# EAGLE schematic NSE2022_BATTERY_ver0 (EAGLE 9.6.0)
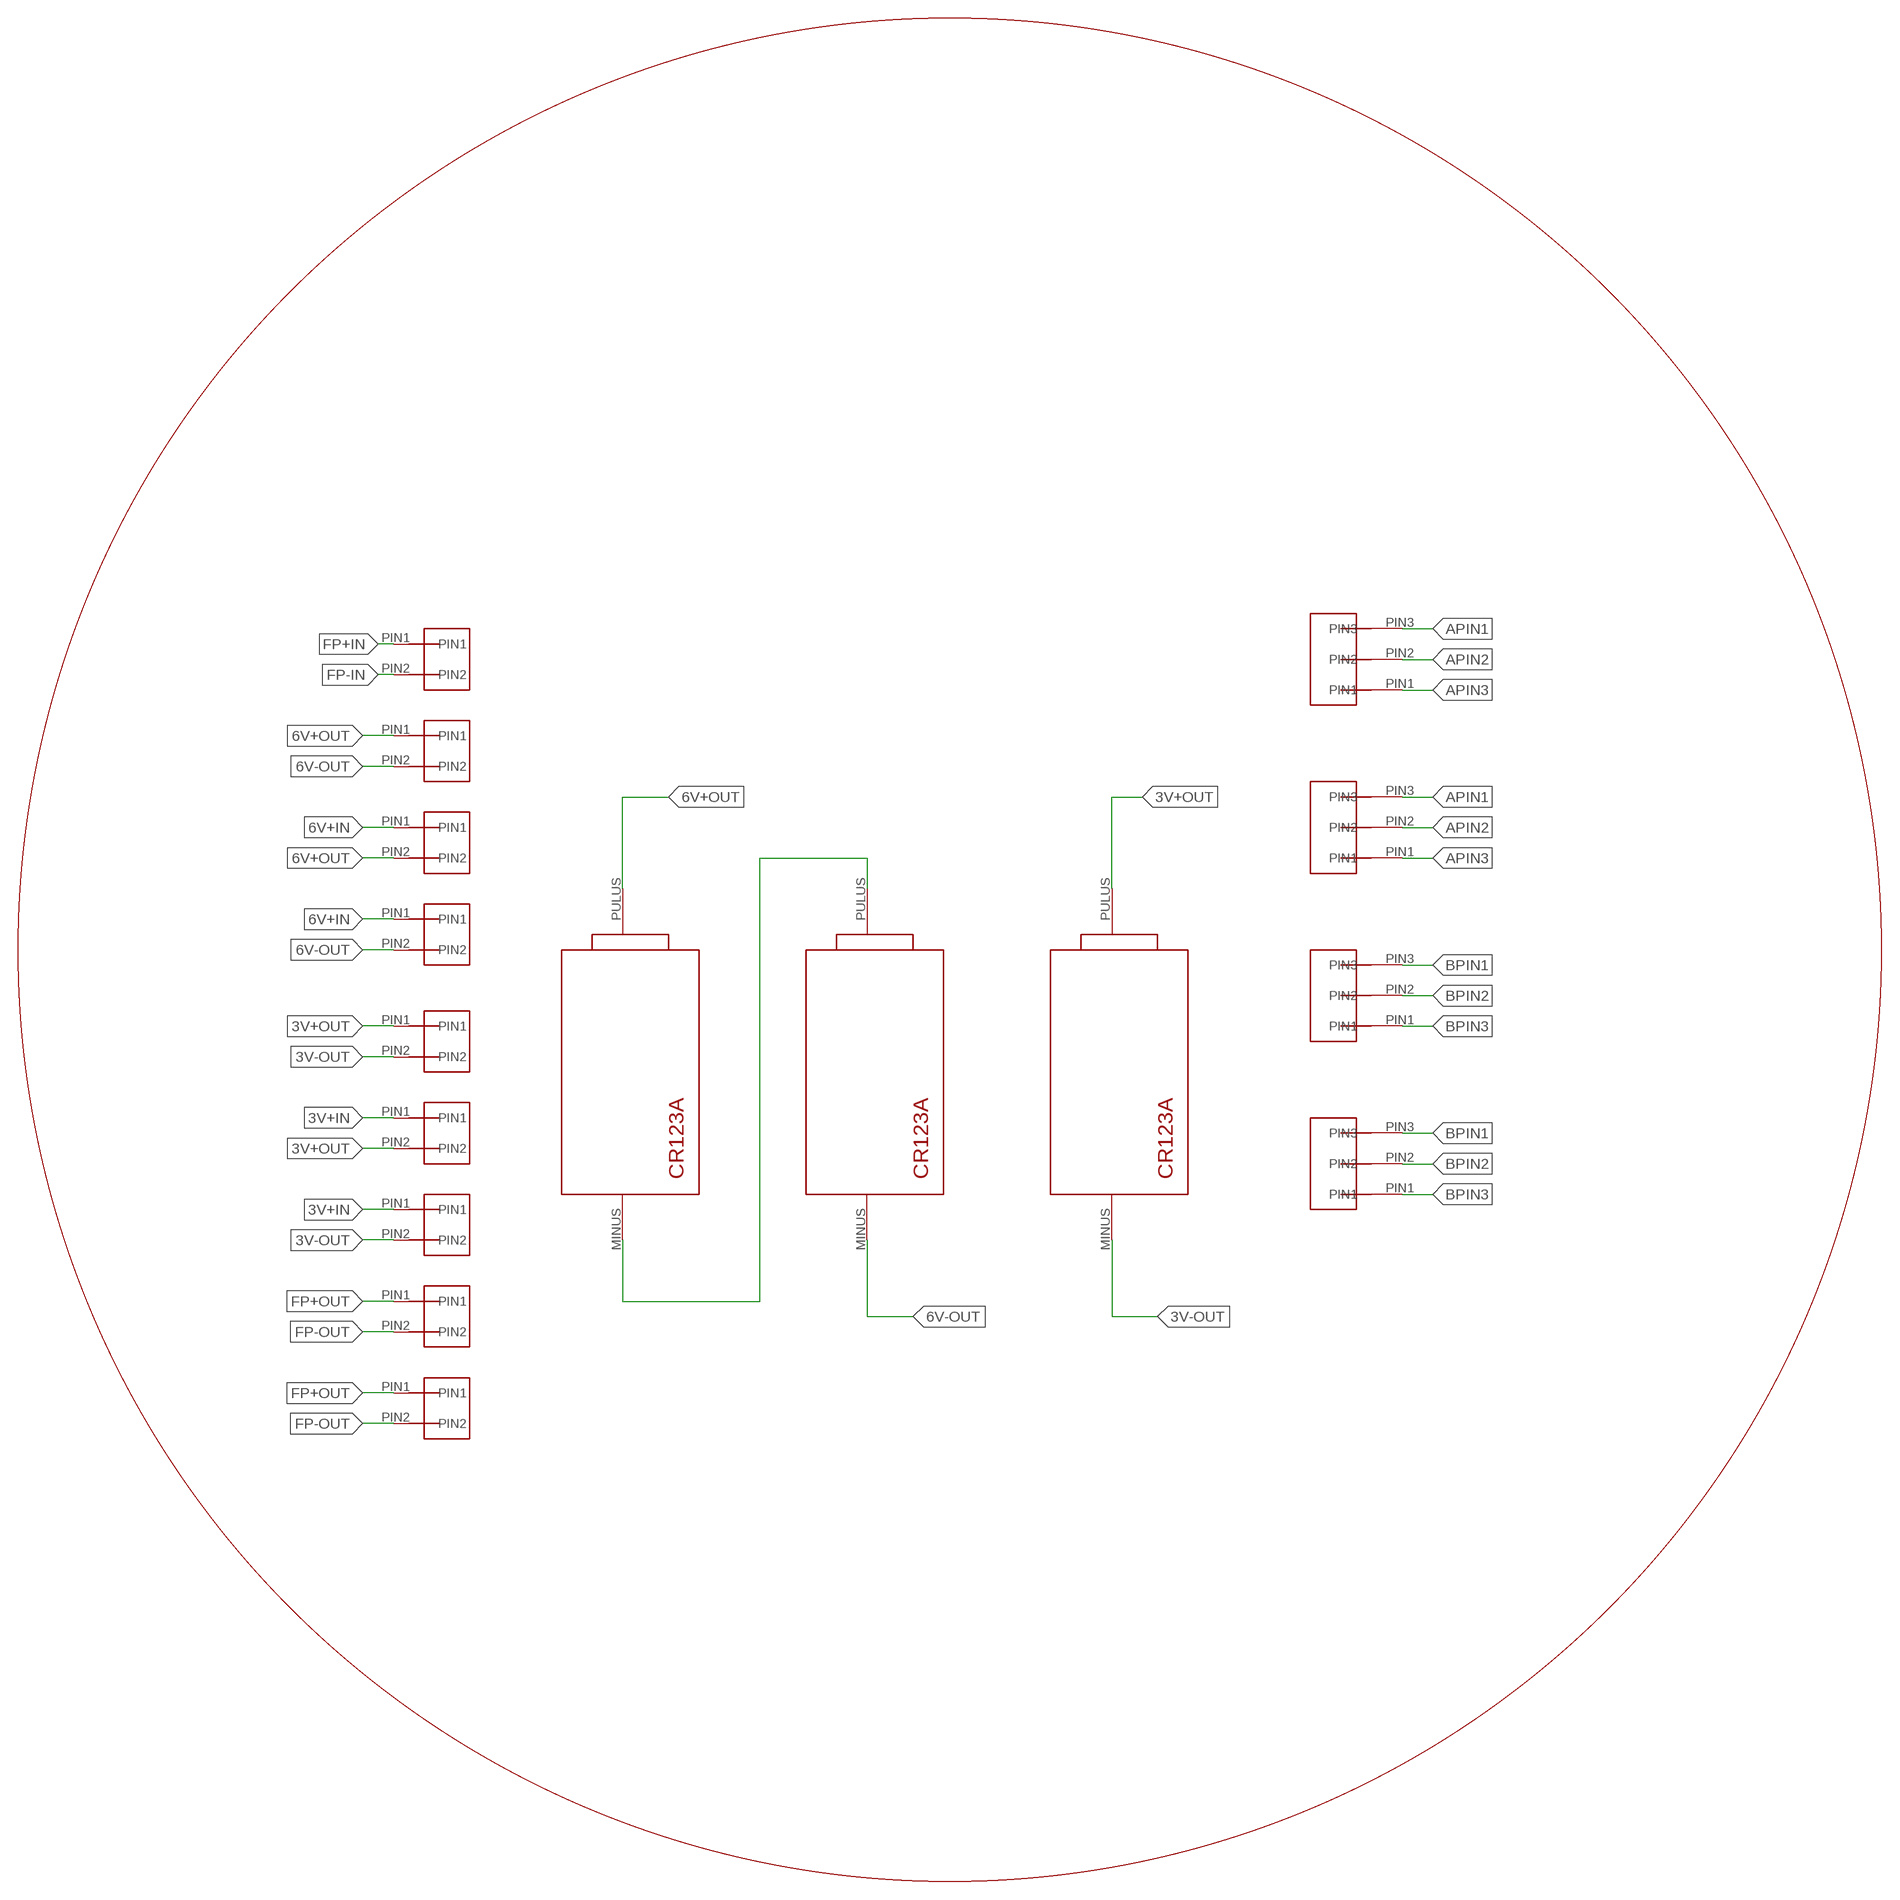
[diagram p0: schematic, sheet 1]

## Parts
U$25  CR123A  [CR123A]
U$34  CR123A  [CR123A]
U$38  CR123A  [CR123A]
U$41  2PIN  [2PIN]
U$45  2PIN  [2PIN]
U$56  2PIN  [2PIN]
U$57  2PIN  [2PIN]
U$58  2PIN  [2PIN]
U$59  3PIN  [3PIN]
U$60  3PIN  [3PIN]
U$61  3PIN  [3PIN]
U$62  3PIN  [3PIN]
U$65  2PIN  [2PIN]
U$66  2PIN  [2PIN]
U$67  2PIN  [2PIN]
U$68  2PIN  [2PIN]

## Nets
3V+IN: U$56.PIN1 U$65.PIN1
3V+OUT: U$38.PULUS(PULAS) U$45.PIN1 U$56.PIN2
3V-OUT: U$38.MINUS U$45.PIN2 U$65.PIN2
6V+IN: U$67.PIN1 U$68.PIN1
6V+OUT: U$25.PULUS(PULAS) U$41.PIN1 U$67.PIN2
6V-OUT: U$34.MINUS U$41.PIN2 U$68.PIN2
APIN1: U$59.PIN3 U$60.PIN3
APIN2: U$59.PIN2 U$60.PIN2
APIN3: U$59.PIN1 U$60.PIN1
BPIN1: U$61.PIN3 U$62.PIN3
BPIN2: U$61.PIN2 U$62.PIN2
BPIN3: U$61.PIN1 U$62.PIN1
FP+IN: U$57.PIN1
FP+OUT: U$58.PIN1 U$66.PIN1
FP-IN: U$57.PIN2
FP-OUT: U$58.PIN2 U$66.PIN2
N$13: U$25.MINUS U$34.PULUS(PULAS)

## Library data of the parts
U$25 U$34 U$38 = CR123A:CR123A
U$41 U$45 U$56-U$58 U$65-U$68 = 2PIN:2PIN
U$59-U$62 = 3PIN:3PIN